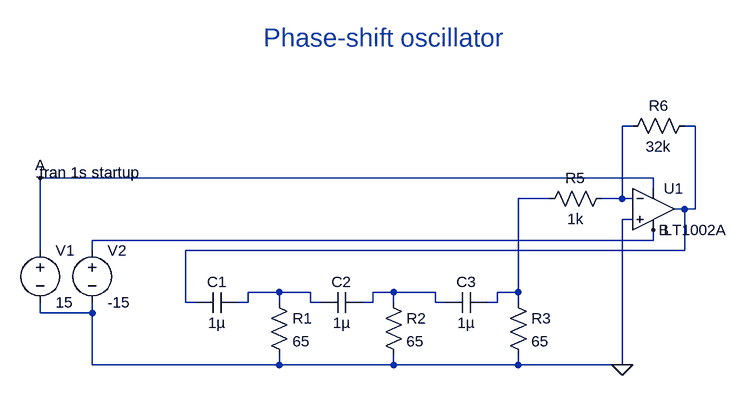
[diagram p0: schematic Phase-shift-oscillator-RC.asc]
Phase-shift-oscillator-RC.asc, the LTspice schematic file:
Version 4.1
SHEET 1 1140 680
WIRE 240 240 240 256
WIRE 416 240 416 256
WIRE 608 240 608 256
WIRE 784 32 768 32
WIRE -128 160 -128 176
WIRE -48 160 -48 176
WIRE 240 256 416 256
WIRE 416 256 608 256
WIRE 240 256 -48 256
WIRE -48 256 -48 176
WIRE -48 176 -128 176
WIRE 608 256 768 256
WIRE 768 256 768 32
FLAG 768 256 0
WIRE 816 -16 816 -32
WIRE -128 80 -128 64
WIRE 816 -32 -128 -32
WIRE -128 -32 -128 64
FLAG -128 -32 A
WIRE 816 48 816 64
WIRE -48 80 -48 64
WIRE 816 64 -48 64
FLAG 816 48 B
WIRE 112 160 96 160
WIRE 864 -112 880 -112
WIRE 848 16 864 16
WIRE 96 160 96 80
WIRE 96 80 864 80
WIRE 864 80 864 16
WIRE 864 16 880 16
WIRE 880 16 880 -112
WIRE 736 0 752 0
WIRE 784 -112 768 -112
WIRE 784 0 768 0
WIRE 752 0 768 0
WIRE 768 0 768 -112
WIRE 560 160 576 160
WIRE 608 160 608 144
WIRE 656 0 640 0
WIRE 576 160 576 144
WIRE 576 144 608 144
WIRE 608 144 608 0
WIRE 608 0 640 0
WIRE 176 160 192 160
WIRE 304 160 288 160
WIRE 240 160 240 144
WIRE 192 160 192 144
WIRE 192 144 240 144
WIRE 240 144 288 144
WIRE 288 144 288 160
WIRE 368 160 384 160
WIRE 496 160 480 160
WIRE 416 160 416 144
WIRE 384 160 384 144
WIRE 384 144 416 144
WIRE 416 144 480 144
WIRE 480 144 480 160
SYMBOL res 224 144 R0
SYMATTR InstName R1
SYMATTR Value 65
SYMBOL res 400 144 R0
SYMATTR InstName R2
SYMATTR Value 65
SYMBOL res 592 144 R0
SYMATTR InstName R3
SYMATTR Value 65
SYMBOL cap 112 176 R270
WINDOW 0 32 32 VTop 2
WINDOW 3 0 32 VBottom 2
SYMATTR InstName C1
SYMATTR Value 1µ
SYMBOL cap 304 176 R270
WINDOW 0 32 32 VTop 2
WINDOW 3 0 32 VBottom 2
SYMATTR InstName C2
SYMATTR Value 1µ
SYMBOL cap 496 176 R270
WINDOW 0 32 32 VTop 2
WINDOW 3 0 32 VBottom 2
SYMATTR InstName C3
SYMATTR Value 1µ
SYMBOL res 752 -16 R90
WINDOW 0 0 56 VBottom 2
WINDOW 3 32 56 VTop 2
SYMATTR InstName R5
SYMATTR Value 1k
SYMBOL Opamps\\LT1002A 816 -48 R0
SYMATTR InstName U1
SYMBOL res 880 -128 R90
WINDOW 0 0 56 VBottom 2
WINDOW 3 32 56 VTop 2
SYMATTR InstName R6
SYMATTR Value 32k
SYMBOL voltage -128 64 R0
WINDOW 123 0 0 Left 2
WINDOW 39 0 0 Left 2
SYMATTR InstName V1
SYMATTR Value 15
SYMBOL voltage -48 64 R0
WINDOW 123 0 0 Left 2
WINDOW 39 0 0 Left 2
SYMATTR InstName V2
SYMATTR Value -15
TEXT -136 -40 Left 2 !.tran 1s startup
TEXT 216 -248 Left 4 ;Phase-shift oscillator

The netlist it stands for:
* Phase-shift-oscillator-RC.asc
R1 N004 0 65
R2 N005 0 65
R3 N003 0 65
C1 N001 N004 1µ
C2 N004 N005 1µ
C3 N005 N003 1µ
R5 N002 N003 1k
X§U1 0 N002 A B N001 LT1002A  ; pins In+ In- V+ V- OUT
R6 N001 N002 32k
V1 A 0 15
V2 B 0 -15
.tran 1s startup
* Phase-shift oscillator
.backanno
.end